# EAGLE schematic minitel (EAGLE 4.09)
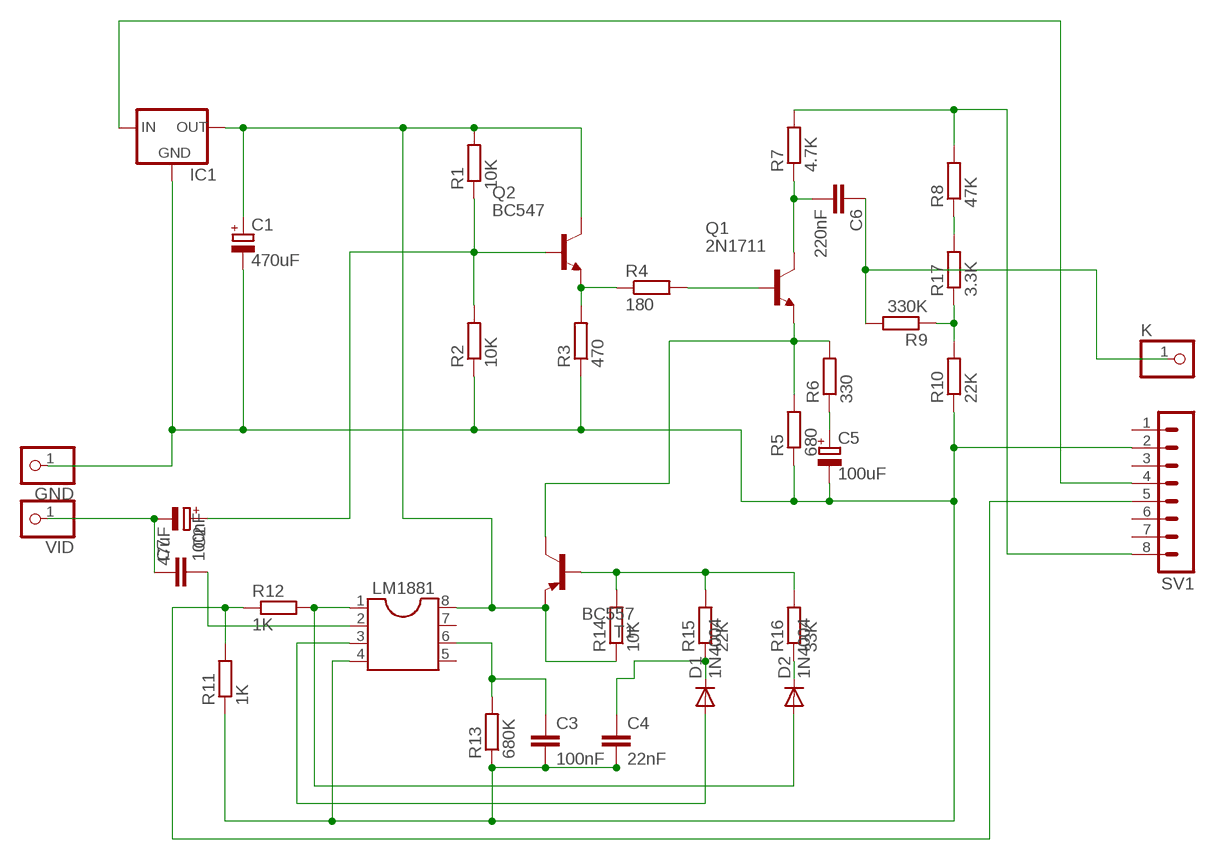
[diagram p0: schematic, sheet 1]

## Parts
C1  470uF  CPOL-EUE5-13  [E5-13]
C2  47uF  CPOL-EUE3.5-10  [E3,5-10]
C3  100nF  C-EU050-025X075  [C050-025X075]
C4  22nF  C-EU050-025X075  [C050-025X075]
C5  100uF  CPOL-EUE5-10.5  [E5-10,5]
C6  220nF  C-EU050-050X075  [C050-050X075]
C7  100nF  C-EU050-050X075  [C050-050X075]
D1  1N4004  [DO41-10]
D2  1N4004  [DO41-10]
GND  PINHD-1X1  [1X01]
IC1  78XXS  [78XXS]
K  PINHD-1X1  [1X01]
LM1881  DIL8  [DIL08]
Q1  2N1711  [TO39]
Q2  BC547  [TO92]
R1  10K  R-EU_0309/12  [0309/12]
R2  10K  R-EU_0309/12  [0309/12]
R3  470  R-EU_0309/12  [0309/12]
R4  180  R-EU_0309/12  [0309/12]
R5  680  R-EU_0309/12  [0309/12]
R6  330  R-EU_0309/12  [0309/12]
R7  4.7K  R-EU_0309/12  [0309/12]
R8  47K  R-EU_0309/12  [0309/12]
R9  330K  R-EU_0309/12  [0309/12]
R10  22K  R-EU_0309/12  [0309/12]
R11  1K  R-EU_0309/12  [0309/12]
R12  1K  R-EU_0309/12  [0309/12]
R13  680K  R-EU_0309/12  [0309/12]
R14  10K  R-EU_0309/12  [0309/12]
R15  22K  R-EU_0309/12  [0309/12]
R16  33K  R-EU_0309/12  [0309/12]
R17  3.3K  R-EU_0309/12  [0309/12]
SV1  MA08-1  [MA08-1]
T1  BC557  [TO92]
VID  PINHD-1X1  [1X01]

## Nets
N$1: R8.1 R17.2
N$2: C2.+ Q2.2(B) R1.1 R2.2
N$3: Q2.1(E) R3.2 R4.1
N$4: Q1.1(E) R5.2 R6.2 T1.3(C)
N$5: R11.2 R12.1 SV1.5
N$6: C6.2 Q1.3(C) R7.1
N$7: Q1.2(B) R4.2
N$8: R14.2 R15.2 R16.2 T1.2(B)
N$11: C6.1 K.1 R9.2
N$12: R9.1 R10.2 R17.1
N$13: C5.+ R6.1
N$14: C4.1 D1.C R15.1
N$15: D2.C R16.1
N$16: D2.A LM1881.1 R12.2
N$19: C1.+ IC1.OUT LM1881.8 Q2.3(C) R1.2 R14.1 T1.1(E)
N$20: C1.- C3.2 C4.2 C5.- GND.1 IC1.GND LM1881.4 R2.1 R3.1 R5.1 R10.1 R11.1 R13.1 SV1.2
N$21: C3.1 LM1881.6 R13.2
N$23: C7.2 LM1881.2
N$24: C2.- C7.1 VID.1
N$25: D1.A LM1881.3
N$26: IC1.IN SV1.4
N$28: R7.2 R8.2 SV1.8
Unconnected: LM1881.5 LM1881.7 SV1.1 SV1.3 SV1.6 SV1.7

## Library data of the parts
C1 C2 C5 = rcl:CPOL-EU: POLARIZED CAPACITOR, European symbol
C3 C4 C6 C7 = rcl:C-EU: CAPACITOR, European symbol
D1 D2 = diode:1N4004: DIODE general purpose rectifier, 1 A
GND K VID = pinhead:PINHD-1X1: PIN HEADER
IC1 = v-reg:78XXS: VOLTAGE REGULATOR
LM1881 = dil:DIL8: SOCKET Dual In Line
Q1 = transistor-npn:2N1711: NPN Transistor
Q2 = transistor-npn:BC547*: NPN Transistor
R1-R17 = rcl:R-EU_: RESISTOR, European symbol
SV1 = con-lstb:MA08-1: PIN HEADER
T1 = transistor-pnp:BC557: PNP Transistor